# EAGLE design chariot_power_a2 (EAGLE 9.2.2)
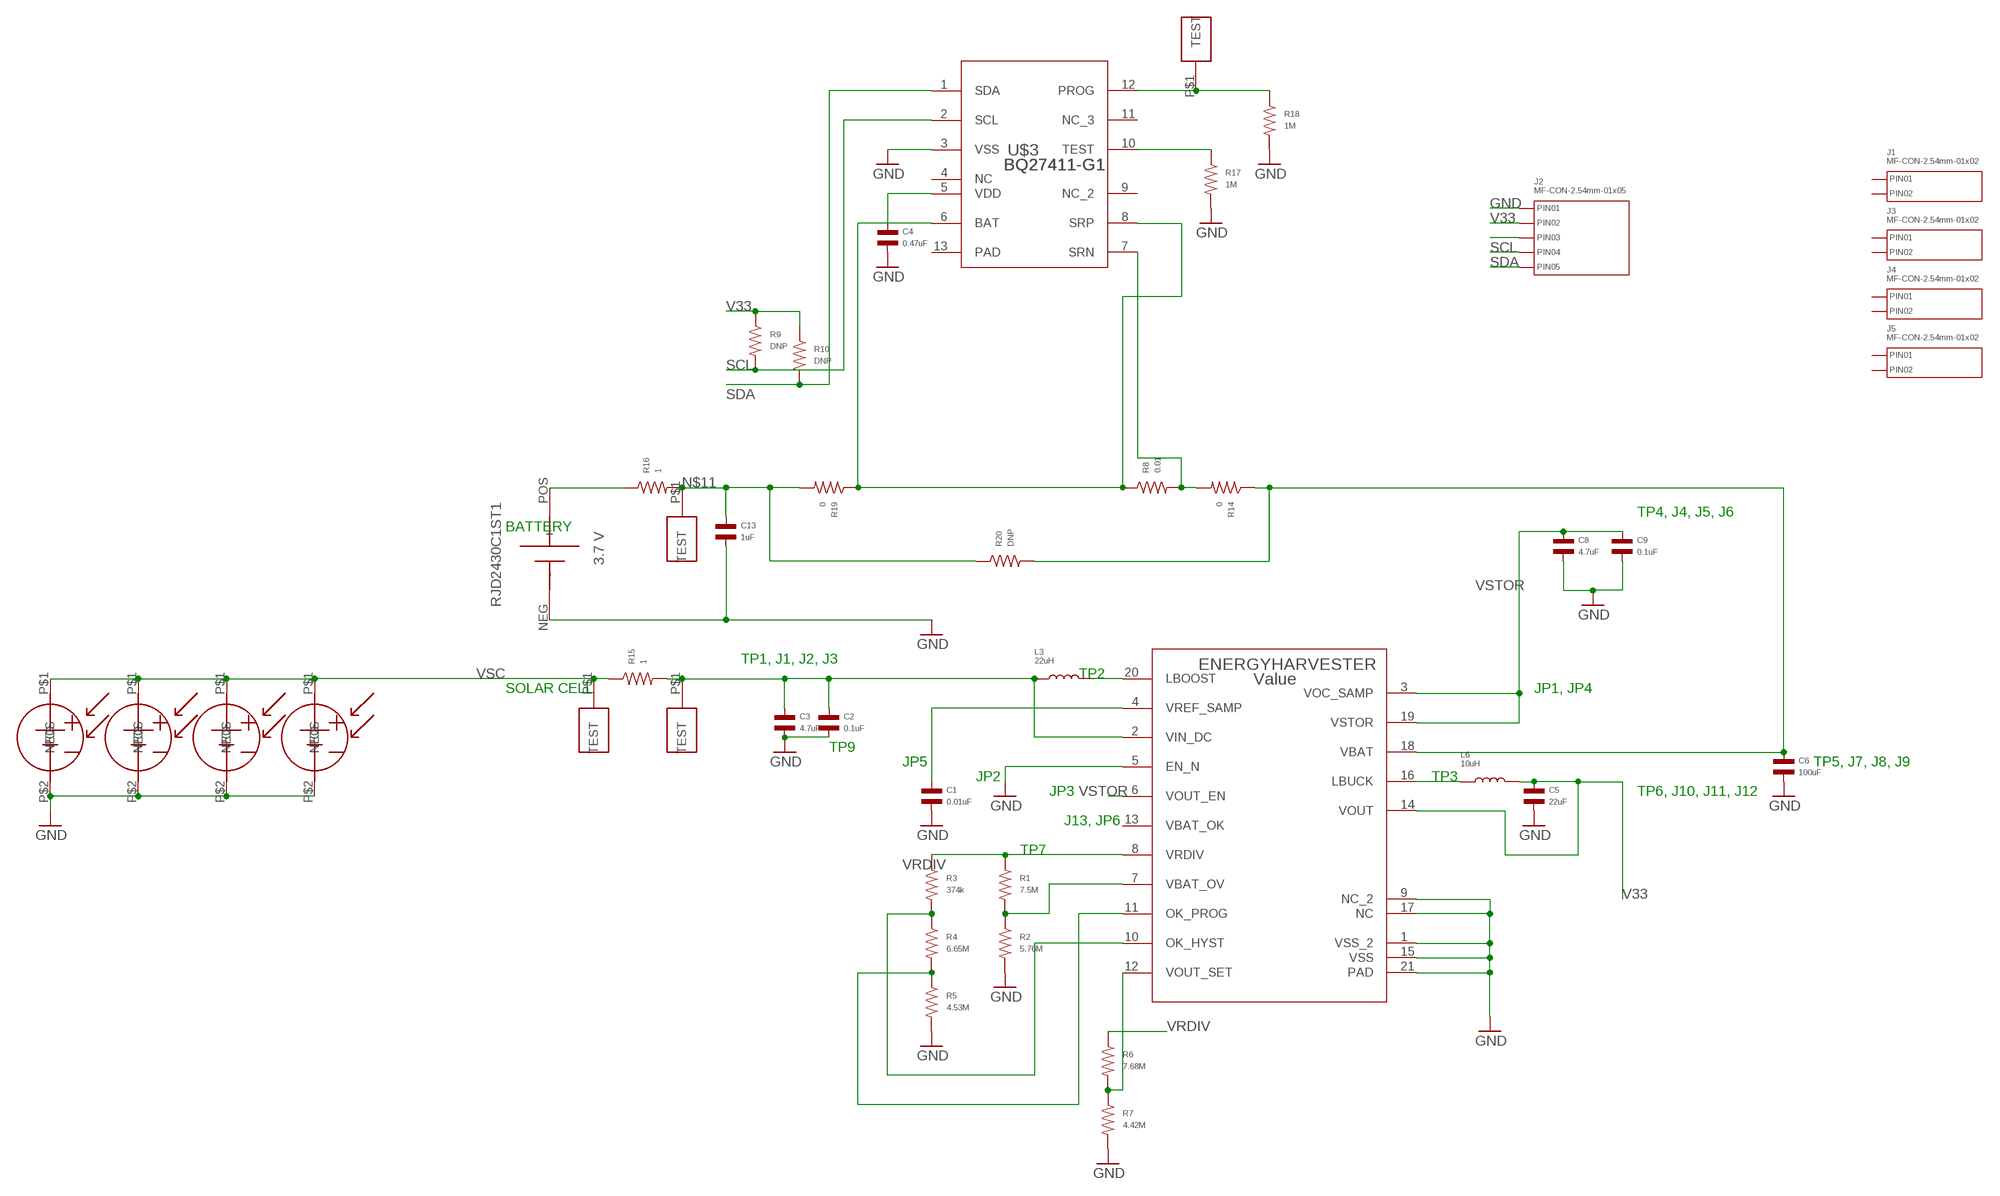
[diagram p0: schematic, sheet 1]

## Parts
C1  0.01uF  CAPACITOR_NP_0603  [C0603]
C2  0.1uF  CAPACITOR_NP_0603  [C0603]
C3  4.7uF  CAPACITOR_NP_0603  [C0603]
C4  0.47uF  CAPACITOR_NP_0603  [C0603]
C5  22uF  CAPACITOR_NP_0603  [C0603]
C6  100uF  CAPACITOR_NP_0805  [C0805]
C8  4.7uF  CAPACITOR_NP_0603  [C0603]
C9  0.1uF  CAPACITOR_NP_0603  [C0603]
C13  1uF  CAPACITOR_NP_0603  [C0603]
ENERGYHARVESTER  Value  BQ25570RGRR  [RGR0020A]
J1  MF-CON-2.54mm-01x02  CON_01X02_PTH_2.54MM  [PTH_2.54MM_01X02]
J2  MF-CON-2.54mm-01x05  CON_01X05_PTH_2.54MM  [PTH_2.54MM_01X05]
J3  MF-CON-2.54mm-01x02  CON_01X02_PTH_2.54MM  [PTH_2.54MM_01X02]
J4  MF-CON-2.54mm-01x02  CON_01X02_PTH_2.54MM  [PTH_2.54MM_01X02]
J5  MF-CON-2.54mm-01x02  CON_01X02_PTH_2.54MM  [PTH_2.54MM_01X02]
L3  22uH  INDUCTOR_0603  [L0603]
L6  10uH  INDUCTOR_0603  [L0603]
R1  7.5M  RESISTOR_0603  [R0603]
R2  5.76M  RESISTOR_0603  [R0603]
R3  374k  RESISTOR_0603  [R0603]
R4  6.65M  RESISTOR_0603  [R0603]
R5  4.53M  RESISTOR_0603  [R0603]
R6  7.68M  RESISTOR_0603  [R0603]
R7  4.42M  RESISTOR_0603  [R0603]
R8  0.01  RESISTOR_0603  [R0603]
R9  DNP  RESISTOR_0603  [R0603]
R10  DNP  RESISTOR_0603  [R0603]
R14  0  RESISTOR_0603  [R0603]
R15  1  RESISTOR_0603  [R0603]
R16  1  RESISTOR_0603  [R0603]
R17  1M  RESISTOR_0603  [R0603]
R18  1M  RESISTOR_0603  [R0603]
R19  0  RESISTOR_0603  [R0603]
R20  DNP  RESISTOR_0603  [R0603]
TP4  TESTPOINT_LOOP  [TESTPOINT_LOOP]
TP6  TESTPOINT_LOOP  [TESTPOINT_LOOP]
TP7  TESTPOINT_LOOP  [TESTPOINT_LOOP]
TP8  TESTPOINT_LOOP  [TESTPOINT_LOOP]
U$2  RJD2430C1ST1.  [RJD2430C1ST1]
U$3  BQ27411-G1  [DRZ0012A]
U$4  SOLARCELL722  [SOLARCELL722]
U$5  SOLARCELL722  [SOLARCELL722]
U$6  SOLARCELL722  [SOLARCELL722]
U$7  SOLARCELL722  [SOLARCELL722]

## Nets
GND: C1.P$2 C2.P$2 C3.P$2 C4.P$2 C5.P$2 C6.P$2 C8.P$2 C9.P$2 C13.P$2 ENERGYHARVESTER.1(VSS_2) ENERGYHARVESTER.5(EN_N) ENERGYHARVESTER.9(NC_2) ENERGYHARVESTER.15(VSS) ENERGYHARVESTER.17(NC) ENERGYHARVESTER.21(PAD) J2.P$1(PIN1) R2.P$2 R5.P$2 R7.P$2 R17.P$2 R18.P$2 U$2.NEG(-) U$3.3(VSS) U$4.P$2(NEG) U$5.P$2(NEG) U$6.P$2(NEG) U$7.P$2(NEG)
N$1: C1.P$1 ENERGYHARVESTER.4(VREF_SAMP)
N$2: ENERGYHARVESTER.20(LBOOST) L3.P$2
N$3: C6.P$1 ENERGYHARVESTER.18(VBAT) R14.P$1 R20.P$2
N$4: ENERGYHARVESTER.16(LBUCK) L6.P$1
N$6: ENERGYHARVESTER.7(VBAT_OV) R1.P$2 R2.P$1
N$7: ENERGYHARVESTER.12(VOUT_SET) R6.P$2 R7.P$1
N$8: R17.P$1 U$3.10(TEST)
N$9: ENERGYHARVESTER.10(OK_HYST) R3.P$2 R4.P$1
N$10: ENERGYHARVESTER.11(OK_PROG) R4.P$2 R5.P$1
N$11: C13.P$1 R16.P$2 R19.P$2 R20.P$1 TP7.P$1(TEST)
N$13: R8.P$2 R14.P$2 U$3.7(SRN)
N$14: R18.P$1 TP8.P$1(TEST) U$3.12(PROG)
N$15: C4.P$1 U$3.5(VDD)
N$16: J2.P$3(PIN3)
SCL: J2.P$4(PIN4) R9.P$2 U$3.2(SCL)
SDA: J2.P$5(PIN5) R10.P$2 U$3.1(SDA)
V33: C5.P$1 ENERGYHARVESTER.14(VOUT) J2.P$2(PIN2) L6.P$2 R9.P$1 R10.P$1
VBAT: R16.P$1 U$2.POS(+)
VBAT2: R8.P$1 R19.P$1 U$3.6(BAT) U$3.8(SRP)
VIN1: C2.P$1 C3.P$1 ENERGYHARVESTER.2(VIN_DC) L3.P$1 R15.P$2 TP6.P$1(TEST)
VRDIV: ENERGYHARVESTER.8(VRDIV) R1.P$1 R3.P$1 R6.P$1
VSC: R15.P$1 TP4.P$1(TEST) U$4.P$1(POS) U$5.P$1(POS) U$6.P$1(POS) U$7.P$1(POS)
VSTOR: C8.P$1 C9.P$1 ENERGYHARVESTER.3(VOC_SAMP) ENERGYHARVESTER.6(VOUT_EN) ENERGYHARVESTER.19(VSTOR)
Unconnected: ENERGYHARVESTER.13(VBAT_OK) J1.P$1(PIN1) J1.P$2(PIN2) J3.P$1(PIN1) J3.P$2(PIN2) J4.P$1(PIN1) J4.P$2(PIN2) J5.P$1(PIN1) J5.P$2(PIN2) U$3.4(NC) U$3.9(NC_2) U$3.11(NC_3) U$3.13(PAD)

## Notes on the sheet
- TP4, J4, J5, J6
- BATTERY
- TP1, J1, J2, J3
- TP2
- SOLAR CELL | JP1, JP4
- TP9
- JP5 | TP5, J7, J8, J9
- JP2 | TP3
- JP3 | TP6, J10, J11, J12
- J13, JP6
- TP7

## Library data of the parts
C1-C6 C8 C9 C13 = MF_Passives:CAPACITOR_NP: Library: MF_Passives Description: Device for Non-Polarized Capacitors. Manufacture part number (MPN) can be added via Attributes. Check https://factory.macrofab.com/parts for the house parts list.; POPULATE: 1
ENERGYHARVESTER = CharIoT:BQ25570RGRR: EVM; ALTERNATEPARTNUMBER: BQ25570RGRT; APPLICATION_BUILDNUMBER: *; COMPTYPE: IC; MANUFACTURER: Texas Instruments; MOUNTTYPE: SMT; PACKAGEREFERENCE: RGR0020A; PARTNUMBER: BQ25570RGRR; PIN_COUNT: 21; REFDES: RefDes; ROHS: Y; TYPE: TYPE
J1 J3-J5 = MF_Connectors:CON_01X02: Library: MF_Connectors Description: Header Connector with 02 Positions and 01 Rows. Use the LABEL Attribute to label the pin on the schematic and PCB. You can remove the attributes on the PCB by using the SMASH function on the part and then deleting the text.; HOUSEPART: YES; MPN: MF-CON-2.54mm-01x02; POPULATE: 1; URL: https://factory.macrofab.com/part/MF-CON-2.54mm-01x02
J2 = MF_Connectors:CON_01X05: Library: MF_Connectors Description: Header Connector with 5 Positions and 01 Rows. Use the LABEL Attribute to label the pin on the schematic and PCB. You can remove the attributes on the PCB by using the SMASH function on the part and then deleting the text.; HOUSEPART: YES; MPN: MF-CON-2.54mm-01x05; POPULATE: 1; URL: https://factory.macrofab.com/part/MF-CON-2.54mm-01x05
L3 L6 = MF_Passives:INDUCTOR: Library: MF_Passives Description: Device for Inductors. Manufacture part number (MPN) can be added via Attributes. Check https://factory.macrofab.com/parts for the house parts list.; POPULATE: 1
R1-R10 R14-R20 = MF_Passives:RESISTOR: Library: MF_Passives Description: Device for Resistors. Manufacture part number (MPN), Voltage, Tolerance, and Wattage Rating can be added via Attributes. Check https://factory.macrofab.com/parts for the house parts list.; POPULATE: 1
TP4 TP6-TP8 = CharIoT:TESTPOINT_LOOP
U$2 = CharIoT:RJD2430C1ST1.: Battery
U$3 = CharIoT:BQ27411-G1: New Fuel Gauge
U$4-U$7 = CharIoT:SOLARCELL722: solar cell

## Board
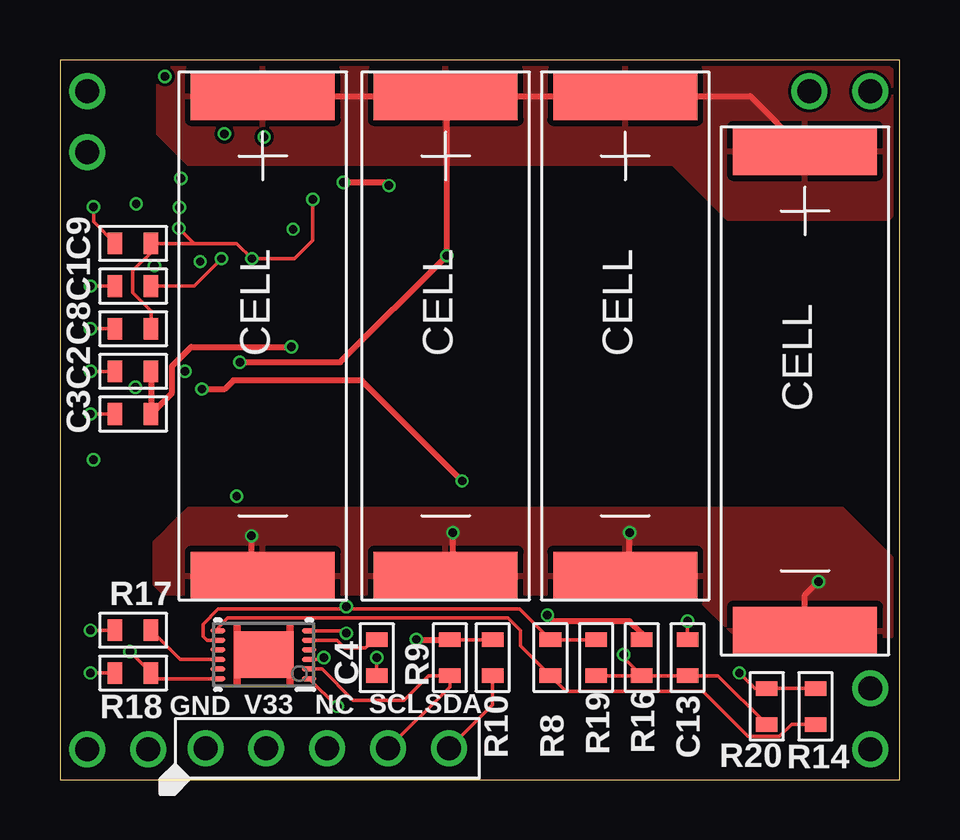
[diagram p1: board, top side]
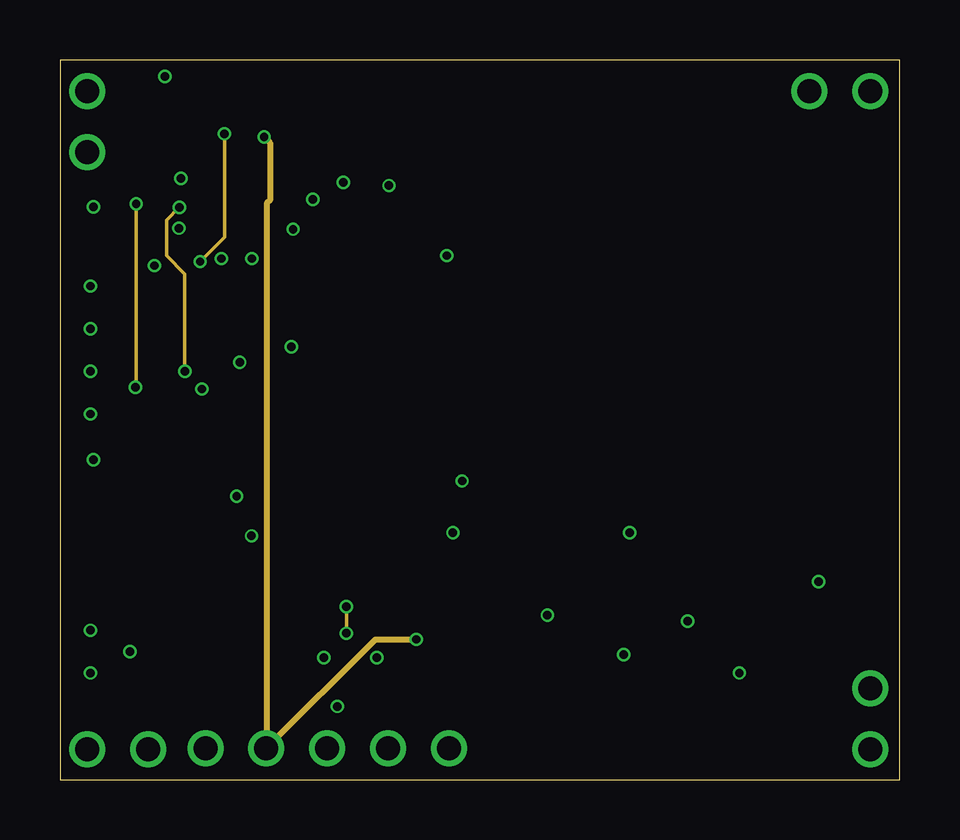
[diagram p2: board, inner layer Route2]
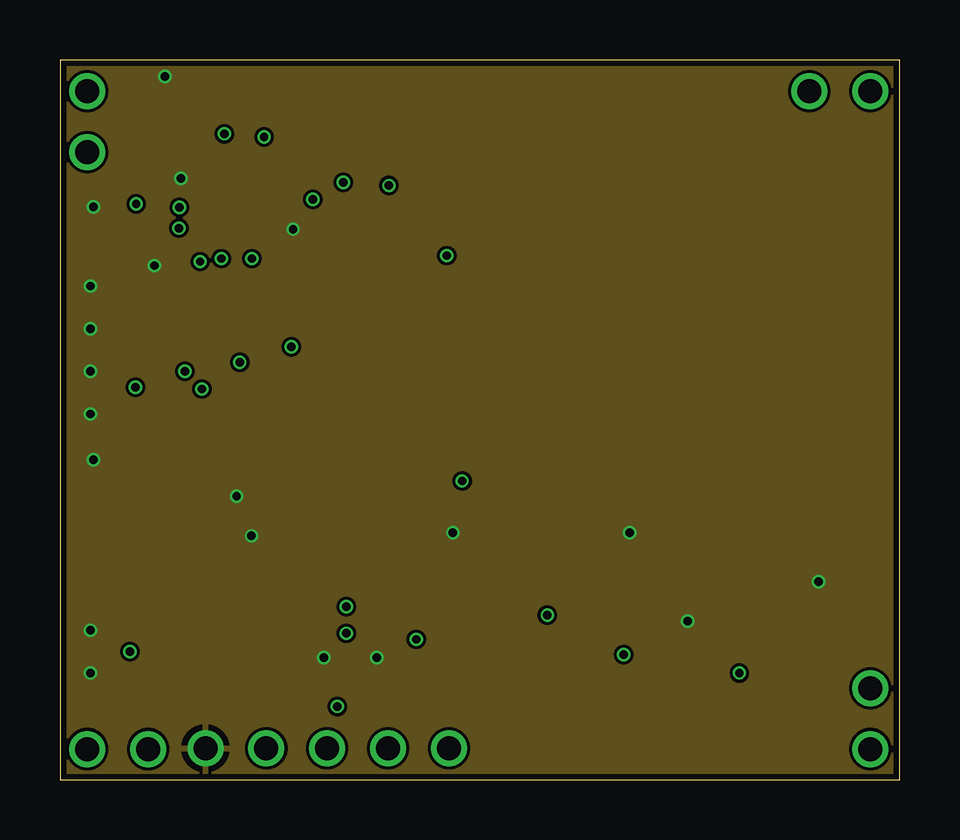
[diagram p3: board, inner layer Route15]
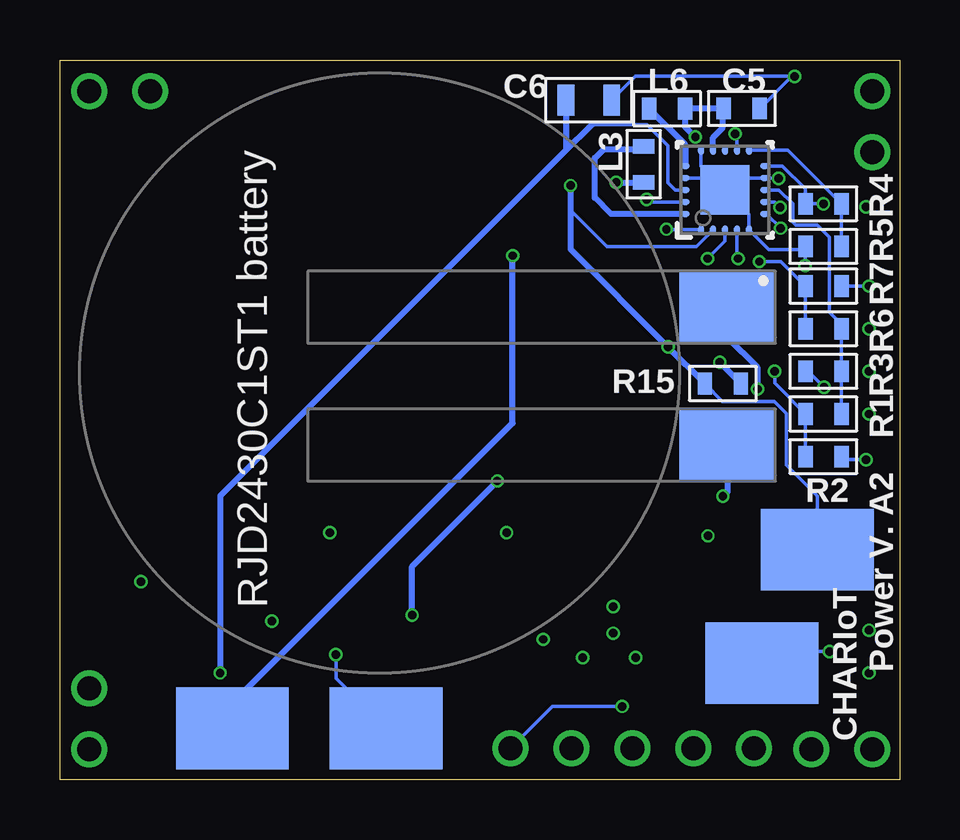
[diagram p4: board, bottom side, seen from below]

Size 35 x 30 mm. Coordinates in mm from the lower left corner, seen from the top.
Outline: 0,0 35,0 35,30 0,30 0,0
Copper layers (1*2*15*16): Top 0.035mm / dielectric 0.23mm / Route2 0.035mm / dielectric 0.93mm / Route15 0.035mm / dielectric 0.23mm / Bottom 0.035mm
Design rules "MF_Standard_4_Layer *": minimum track width 5mil, minimum drill 10mil, track to track 5mil, track to pad 5mil, pad to pad 5mil, via to via 5mil, smd to smd 0mil, copper to edge 10mil, drill to drill 10mil, minimum pad ring 4mil, minimum via ring 4mil, stop-mask expansion 2mil, vias tented up to drill 25mil, thermal gap 10mil

### Footprints (pad centres in the part's own frame; a part is rotated, then mirrored left to right if it is on the bottom)
C0603 = smd 0.6 x 0.9: P$1 -0.75,0; P$2 0.75,0
C0805 = smd 0.7 x 1.3: P$1 -0.95,0; P$2 0.95,0
RGR0020A = smd 0.36 x 0.24: 1 -1.65,1; 2 -1.65,0.5; 3 -1.65,0; 4 -1.65,-0.5; 5 -1.65,-1; 11 1.65,-1; 12 1.65,-0.5; 13 1.65,0; 14 1.65,0.5; 15 1.65,1 | smd 0.24 x 0.36: 6 -1,-1.65; 7 -0.5,-1.65; 8 0,-1.65; 9 0.5,-1.65; 10 1,-1.65; 16 1,1.65; 17 0.5,1.65; 18 0,1.65; 19 -0.5,1.65; 20 -1,1.65 | smd 2.05 x 2.05: 21 0,0 | smd 0.5 x 0.5: V 0,-0.775
PTH_2.54MM_01X02 = drill 1: P$1 -1.27,0; P$2 1.27,0
PTH_2.54MM_01X05 = drill 1: P$1 -5.08,0; P$2 -2.54,0; P$3 0,0; P$4 2.54,0; P$5 5.08,0
L0603 = smd 0.6 x 0.9: P$1 -0.75,0; P$2 0.75,0
R0603 = smd 0.6 x 0.9: P$1 -0.75,0; P$2 0.75,0
TESTPOINT_LOOP = smd 4.7 x 3.4: P$1 0,0
RJD2430C1ST1 = smd 3 x 4: NEG 3,14.5; POS -2.75,14.5
DRZ0012A = smd 0.6 x 0.2: 1 -1.9,1; 2 -1.9,0.6; 3 -1.9,0.2; 4 -1.9,-0.2; 5 -1.9,-0.6; 6 -1.9,-1; 7 1.9,-1; 8 1.9,-0.6; 9 1.9,-0.2; 10 1.9,0.2; 11 1.9,0.6; 12 1.9,1 | smd 2.45 x 1.95: 13 0,0 | smd 0.5 x 0.5: V 0,-0.725
SOLARCELL722 = smd 6 x 2: P$1 3.5,21; P$2 3.5,1

### Placement (x,y rotation side)
C1  3.05,20.57 180 top
C2  3.05,17.02 180 top
C3  3.05,15.24 180 top
C4  13.21,5.08 270 top
C5  6.58,27.98 0 bottom
C6  12.95,28.32 0 bottom
C8  3.05,18.8 180 top
C9  3.05,22.35 180 top
C13  26.16,5.08 90 top
ENERGYHARVESTER  7.28,24.58 90 bottom
J1  2.41,1.27 0 top
J2  11.14,1.3 0 top
J3  33.78,2.54 90 top
J4  32.51,28.7 0 top
J5  1.14,27.43 90 top
L3  10.67,25.65 90 bottom
L6  9.69,27.97 0 bottom
R1  3.17,15.24 180 bottom
R2  3.17,13.46 0 bottom
R3  3.17,17.02 180 bottom
R4  3.17,24 0 bottom
R5  3.17,22.23 180 bottom
R6  3.17,18.8 180 bottom
R7  3.17,20.57 0 bottom
R8  20.45,5.08 270 top
R9  16.26,5.08 270 top
R10  18.03,5.08 270 top
R14  31.5,3.05 270 top
R15  7.37,16.51 180 bottom
R16  24.26,5.08 270 top
R17  3.05,6.22 180 top
R18  3.05,4.45 180 top
R19  22.35,5.08 270 top
R20  29.46,3.05 90 top
TP4  27.81,2.13 0 bottom
TP6  3.43,9.58 0 bottom
TP7  21.41,2.13 0 bottom
TP8  5.74,4.85 180 bottom
U$2  21.67,16.94 270 bottom
U$3  8.48,5.21 180 top
U$4  27.56,5.21 0 top
U$5  20.07,7.49 0 top
U$6  12.57,7.49 0 top
U$7  4.95,7.49 0 top

### Tracks (layer width: path | path; a pad name or v marks a point on that pad's centre or on a via)
GND  (via drill 0.35)
  Top 0.152: C3.P$2 v1.27,15.24 | C2.P$2 v1.27,17.02 | C8.P$2 v1.27,18.8 | U$3.3 10.92,5.01 v11,5.09 | C13.P$2 v26.16,6.6 | C1.P$2 v1.27,20.57 | C4.P$2 v13.21,5.08 | R18.P$2 v1.27,4.45 | R17.P$2 v1.27,6.22 | C9.P$2 1.4,23.25 v1.4,23.88
  Top 0.254: U$6.P$2 16.38,8.8 v16.38,10.29 | U$5.P$2 23.75,8.68 v23.75,10.29 | U$7.P$2 7.99,8.96 v7.99,10.16 | U$4.P$2 31.06,7.69 v31.62,8.26
  Bottom 0.152: R7.P$2 v1.27,20.57 | R2.P$2 2.3,13.34 v1.4,13.34 | v5.04,25.06 5.06,25.08 ENERGYHARVESTER.9 6.8,25.08 ENERGYHARVESTER.21 | ENERGYHARVESTER.15 8.28,25.58 7.78,25.08 | 7.78,25.08 ENERGYHARVESTER.21 | ENERGYHARVESTER.21 6.28,23.58 ENERGYHARVESTER.5 5.45,22.1 3.92,22.1 | ENERGYHARVESTER.17 7.78,25.08 | ENERGYHARVESTER.1 9.7,22.93 v9.72,22.95 | R5.P$2 3.92,22.1 | 3.92,22.1 3.92,21.44 v3.94,21.43 | C5.P$2 4.49,29.31 v4.38,29.31 11.01,29.31 C6.P$2
  Bottom 0.254: U$2.NEG 7.17,12.01 v7.37,11.81
  pour Route15: 0,29.97 0,0 35.05,0 35.05,29.97
  pour Top: 4.7,10.67 4.32,10.29 3.94,9.91 3.94,8.13 4.32,7.75 26.42,7.75 28.19,5.97 34.67,5.97 34.92,6.22 34.92,9.02 33.78,10.16 32.64,11.3 32.51,11.3 5.33,11.3 4.7,10.67
N$1  (via drill 0.35)
  Top 0.152: v6.73,21.72 5.59,20.57 C1.P$1
  Bottom 0.152: ENERGYHARVESTER.4 6.78,21.77 v6.73,21.72
N$2
  Bottom 0.254: ENERGYHARVESTER.20 12.02,23.58 12.7,24.26 12.7,25.91 12.32,26.29 10.78,26.29 L3.P$2
N$3  (via drill 0.35)
  Top 0.152: R14.P$1 R20.P$2 28.97,3.8 v28.32,4.45
  Bottom 0.152: ENERGYHARVESTER.18 9.34,24.58 9.65,24.89 9.65,26.43 10.54,27.31 12.83,27.31 | 13.9,26.24 13.98,26.17
  Bottom 0.254: v28.32,4.45 28.32,11.82 13.98,26.17 12.83,27.31 | C6.P$1 13.9,26.24
N$4
  Bottom 0.254: L6.P$1 8.93,26.46 ENERGYHARVESTER.16
N$6  (via drill 0.35)
  Route2 0.152: v5.21,17.02 5.21,21.08 4.45,21.84 4.45,23.32 v4.97,23.85
  Bottom 0.152: R2.P$1 R1.P$2 5.21,16.52 v5.21,17.02 | v4.97,23.85 5.2,24.08 ENERGYHARVESTER.7
N$7  (via drill 0.35)
  Route2 0.152: v5.84,21.59 6.86,22.61 v6.86,26.92
  Bottom 0.152: R6.P$2 R7.P$1 4.95,21.59 v5.84,21.59 | v6.86,26.92 6.78,26.85 ENERGYHARVESTER.12
N$8
  Top 0.152: U$3.10 5.01,5.01 R17.P$1
N$9  (via drill 0.35)
  Route2 0.152: v3.17,24 3.17,16.38 v3.14,16.35
  Bottom 0.152: ENERGYHARVESTER.10 4.88,25.58 3.92,24.63 R4.P$1 v3.17,24 | v3.14,16.35 3.81,17.02 R3.P$2
N$10
  Bottom 0.152: R5.P$1 R4.P$2 4.65,26.23 ENERGYHARVESTER.11
N$11  (via drill 0.35)
  Top 0.152: R16.P$2 R19.P$2 | R16.P$2 C13.P$1 27.43,4.33 R20.P$1 | v23.5,5.21 23.5,5.09 R16.P$2
  Bottom 0.152: TP7.P$1 23.5,4.22 v23.5,5.21
N$13
  Top 0.152: U$3.7 6.58,6.33 6.99,6.73 18.68,6.73 19.2,6.21 19.2,5.58 R8.P$2 21.09,3.68 26.8,3.68 28.68,1.79 30,1.79 30.5,2.3 R14.P$2
N$14  (via drill 0.35)
  Top 0.152: U$3.12 4.04,4.21 R18.P$1 v2.92,5.32 v2.92,5.33
  Bottom 0.152: v2.92,5.33 5.26,5.33 TP8.P$1
N$15
  Top 0.152: U$3.5 11.55,5.81 11.87,5.49 12.74,5.49 13.08,5.83 C4.P$1
SCL
  Top 0.152: 16.26,4.32 16.26,3.87 J2.P$4 | 16.26,4.32 R9.P$2 | U$3.2 10.92,4.61 12.23,3.3 14.35,3.3 15.37,4.32 16.26,4.32
SDA  (via drill 0.35)
  Top 0.152: R10.P$2 18.03,3.11 J2.P$5 | U$3.1 11.54,3.05 v11.56,3.05
  Bottom 0.152: v11.56,3.05 14.47,3.05 J2.P$5
V33  (via drill 0.35)
  Top 0.152: R9.P$1 R10.P$1
  Top 0.254: v14.86,5.84 14.87,5.83 R9.P$1
  Route2 0.254: v8.51,26.79 8.75,26.55 8.75,24.16 8.62,24.02 8.62,1.44 8.6,1.42 J2.P$2 13.15,5.84 v14.86,5.84
  Bottom 0.152: L6.P$2 | 7.37,27.94 C5.P$1
  Bottom 0.254: ENERGYHARVESTER.14 7.78,26.76 7.37,27.18 7.37,27.94 | C5.P$1 | C5.P$1 L6.P$2 | L6.P$2 8.94,27.22 v8.51,26.79
VBAT  (via drill 0.35)
  Top 0.254: v5.91,16.28 6.88,16.28 7.24,16.64 12.57,16.64 v16.76,12.45 | R16.P$1 24.26,6.1 23.75,6.6 20.57,6.6 v20.32,6.86
  Bottom 0.254: v5.91,16.28 5.93,16.3 5.93,17.19 7.17,18.43 U$2.POS | v20.32,6.86 20.32,8.89 v16.76,12.45
VBAT2  (via drill 0.35)
  Top 0.152: U$3.8 6.13,5.81 5.97,5.97 5.97,6.48 6.6,7.11 11.84,7.11 | 11.84,7.11 v11.94,7.21 | U$3.6 11.83,6.21 v11.94,6.1 | 11.84,7.11 19.16,7.11 R8.P$1 R19.P$1
  Route2 0.152: v11.94,6.1 v11.94,7.21
VIN1  (via drill 0.35)
  Top 0.254: C2.P$1 C3.P$1 4.68,16.12 4.68,17.24 5.47,18.03 v9.65,18.03 v9.65,18.04 | v13.72,24.77 13.59,24.89 v11.81,24.89
  Bottom 0.152: ENERGYHARVESTER.2 7.96,22.75 7.96,22.74 8.47,22.23 12.19,22.23 13.72,23.75 v13.72,24.77 | TP6.P$1 3.43,11.82 4.71,13.11 4.71,15.27 5.21,15.77 7.38,15.77 R15.P$2
  Bottom 0.254: v13.72,24.77 13.72,22.11 v9.65,18.04 R15.P$2 | v11.81,24.89 L3.P$1
VRDIV
  Bottom 0.152: ENERGYHARVESTER.8 5.02,24.58 4.45,24 4.45,23.24 4.32,23.11 3.43,23.11 2.93,22.61 2.93,19.49 2.42,18.98 R6.P$1 R3.P$1 2.42,16.89 R1.P$1
VSC  (via drill 0.35)
  Top 0.254: 16.26,28.49 U$6.P$1 U$7.P$1 | 16.26,28.49 U$5.P$1 28.77,28.49 U$4.P$1 | v7.49,17.4 11.68,17.4 v16.13,21.84 16.13,28.37 16.26,28.49
  Bottom 0.254: R15.P$1 7.49,17.39 v7.49,17.4 | TP4.P$1 27.81,3.17 16.13,14.86 v16.13,21.84
  pour Top: 4.57,29.97 4.06,29.46 4.06,26.92 5.33,25.65 25.53,25.65 27.81,23.37 34.54,23.37 34.92,23.75 34.92,29.34 34.29,29.97
VSTOR  (via drill 0.35)
  Top 0.152: C8.P$1 3.8,19.54 3.04,20.29 3.04,21.21 3.8,21.97 C9.P$1 5.59,22.35 | v10.54,24.19 10.54,22.48 9.78,21.72 v8,21.72 7.37,22.35 5.59,22.35 | v4.95,22.99 5.59,22.35
  Bottom 0.152: ENERGYHARVESTER.3 7.28,22.44 v8,21.72 | ENERGYHARVESTER.19 10.43,24.08 v10.54,24.19 | ENERGYHARVESTER.6 5.54,23.58 v4.95,22.99

### Text on the board
tNames: GND | V33 | NC | SCL | SDA
bNames: Power V. A2 | CHARIoT